# Altium schematic sheet GPS_SCHE.SchDoc
size A4
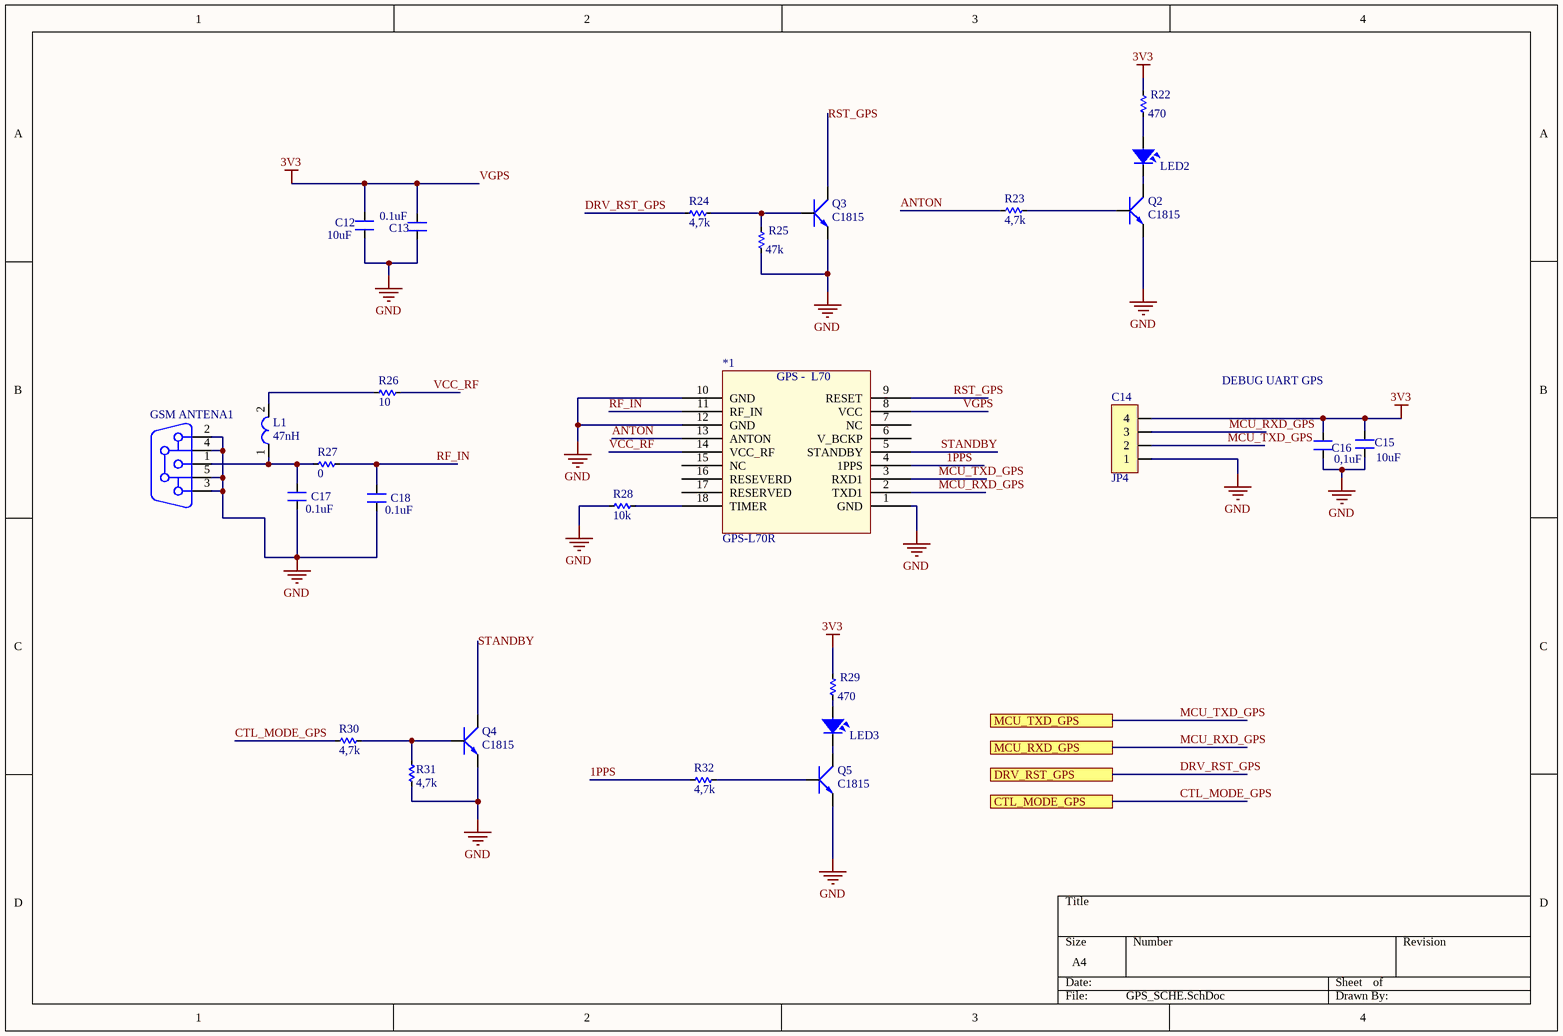
[diagram p0: GPS_SCHE.SchDoc]

## Parts
*1  GPS-L70R  [GPS_L70R]
C12  10uF  [res 0805 - duplicate]
C13  0.1uF  [res 0805 - duplicate]
C14  JP4  [JP4-C1T]
C15  10uF  [res 0805 - duplicate]
C16  0,1uF  [res 0805 - duplicate]
C17  0.1uF  [res 0805 - duplicate]
C18  0.1uF  [res 0805 - duplicate]
GSM_ANTENA1  (no value)  [anten]
L1  47nH  [res 0805 - duplicate]
LED2  LED  [res 0805 - duplicate]  (value not drawn)
LED3  LED  [res 0805 - duplicate]  (value not drawn)
Q2  C1815  [SOT23B]
Q3  C1815  [SOT23B]
Q4  C1815  [SOT23B]
Q5  C1815  [SOT23B]
R22  470  [res 0805 - duplicate]
R23  4,7k  [res 0805 - duplicate]
R24  4,7k  [res 0805 - duplicate]
R25  47k  [res 0805 - duplicate]
R26  10  [res 0805 - duplicate]
R27  0  [res 0805 - duplicate]
R28  10k  [res 0805 - duplicate]
R29  470  [res 0805 - duplicate]
R30  4,7k  [res 0805 - duplicate]
R31  4,7k  [res 0805 - duplicate]
R32  4,7k  [res 0805 - duplicate]

## Ports
CTL_MODE_GPS, DRV_RST_GPS, MCU_RXD_GPS, MCU_TXD_GPS

## Nets
GND: *1.1(GND) *1.10(GND) *1.12(GND) C12.1 C13.1 C14.1 C15.1 C16.1 C17.1 C18.1 GSM_ANTENA1.2 GSM_ANTENA1.3 GSM_ANTENA1.4 GSM_ANTENA1.5 Q2.1(E) Q3.1(E) Q4.1(E) Q5.1(E) R25.1 R28.1 R31.1
VGPS: *1.8(VCC) C12.2 C13.2 C14.4 C15.2 C16.2 R22.2 R29.2  [also labelled 3V3]
1PPS: *1.4(1PPS) R32.1
ANTON: *1.13(ANTON) R23.1
CTL_MODE_GPS: R30.1 ; port CTL_MODE_GPS
DRV_RST_GPS: R24.1 ; port DRV_RST_GPS
MCU_RXD_GPS: *1.2(TXD1) C14.3 ; port MCU_RXD_GPS
MCU_TXD_GPS: *1.3(RXD1) C14.2 ; port MCU_TXD_GPS
RF_IN: *1.11(RF_IN) C18.2 R27.2
RST_GPS: *1.9(RESET) Q3.2(C)
STANDBY: *1.5(STANDBY) Q4.2(C)
VCC_RF: *1.14(VCC_RF) R26.2
Net*1_18: *1.18(TIMER) R28.2
NetC17_2: C17.2 GSM_ANTENA1.1 L1.1 R27.1
NetL1_2: L1.2 R26.1
NetLED2_1: LED2.1 R22.1
NetLED2_2: LED2.2 Q2.2(C)
NetLED3_1: LED3.1 R29.1
NetLED3_2: LED3.2 Q5.2(C)
NetQ2_3: Q2.3(B) R23.2
NetQ3_3: Q3.3(B) R24.2 R25.2
NetQ4_3: Q4.3(B) R30.2 R31.2
NetQ5_3: Q5.3(B) R32.2

Not connected (* = marked no-connect by the designer): *1 6(V_BCKP) 7(NC) 15(NC) 16(RESEVERD) 17(RESERVED)

## Notes on the sheet
- DEBUG UART GPS
- (in symbol GPS-L70) GPS -  L70

## Library data of the parts
*1 = GPS-L70
C12 C15 C16 = CN: Value: 0,1uF/300V; Designed by: VanDungEvn
C13 C17 C18 = CM: Cap SMD; Value: 103
C14 = JP4: WR-PHD 2.54 mm Angled Socket Header; Manufacturer: W¨¹rth Elektronik eiSos GmbH; partNo: 613004143121; ComponentLink1 Description: Manufacturer; ComponentLink2 Description: Datasheet; NoPins: 04; Created Date: 29 March 2013; ComponentLink1URL: http://www.we-online.com; ComponentLink2URL: http://katalog.we-online.de/em/datasheet/6130xx143121.pdf; Created by: Karrer Zheng
GSM_ANTENA1 = CON Ant: CONNECTOR ANTEN; partNo: 210111003; Manufacturer: Würth Elektronik eiSos GmbH; ComponentLink1Description: Manufacturer; ComponentLink1URL: http://www.we-online.de; Created by: Christin Zierenner; Created Date: May 2012; ComponentLink2Description: Datasheet; ComponentLink2URL: http://katalog.we-online.de/kataloge/eisos/index.php?language=en&pf=Filter_gerade
L1 = L-SMD-1: partNo: 78477010; Manufacturer: Wurth Elektronik; Inductance: 1.0 μH; ComponentLink1Description: Manufacturer; ComponentLink1URL: http://www.we-online.de; Created by: Baojun Chen; Created Date: Nov.2015; ComponentLink2Description: Datasheet; ComponentLink2URL: http://katalog.we-online.de/pbs/datasheet/78477010.pdf; WED: https://www.digikey.com/product-detail/en/wurth-electronics-inc/744786147A/732-6271-2-ND/5087158
LED2 LED3 = LED SMD: Value: LED 3 - 5 ly 2 Colour
Q2-Q5 = C1815: NPN 600mW, ECB; Value: C1815
R22-R32 = Res-SMD: Resistor; Manufacturer: Generic Components; Class: Passive; Published: 08/06/2000; Publisher: Altium Hobart Technology Centre